# Altium schematic sheet [13]-KB_CONNECTORS.SchDoc
size A4
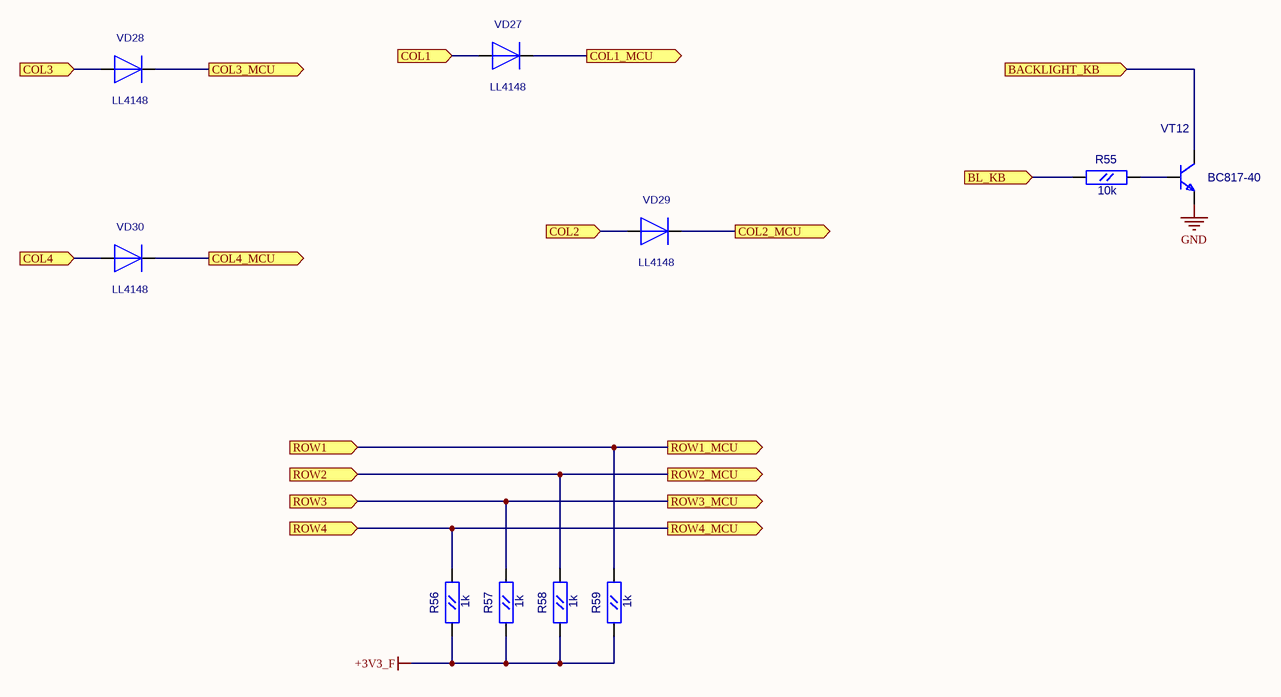
[diagram p0: [13]-KB_CONNECTORS.SchDoc]

## Parts
R55  10k  [RC0603]
R56  1k  [RC0603]
R57  1k  [RC0603]
R58  1k  [RC0603]
R59  1k  [RC0603]
VD27  LL4148  [SOD-80]
VD28  LL4148  [SOD-80]
VD29  LL4148  [SOD-80]
VD30  LL4148  [SOD-80]
VT12  BC817-40  [SOT-23(123)]

## Ports
BACKLIGHT_KB (in), BL_KB (in), COL1 (in), COL1_MCU (out), COL2 (in), COL2_MCU (out), COL3 (in), COL3_MCU (out), COL4 (in), COL4_MCU (out), ROW1 (in), ROW1_MCU (out), ROW2 (in), ROW2_MCU (out), ROW3 (in), ROW3_MCU (out), ROW4 (in), ROW4_MCU (out)

## Nets
+3V3_F: R56.1(A) R57.1(A) R58.1(A) R59.1(A)
GND: VT12.2(E)
BACKLIGHT_KB: VT12.3(C) ; port BACKLIGHT_KB
BL_KB: R55.1(A) ; port BL_KB
COL1: VD27.1(-) ; port COL1
COL1_MCU: VD27.2(+) ; port COL1_MCU
COL2: VD29.1(-) ; port COL2
COL2_MCU: VD29.2(+) ; port COL2_MCU
COL3: VD28.1(-) ; port COL3
COL3_MCU: VD28.2(+) ; port COL3_MCU
COL4: VD30.1(-) ; port COL4
COL4_MCU: VD30.2(+) ; port COL4_MCU
ROW1: R59.2(B) ; port ROW1_MCU, port ROW1
ROW2: R58.2(B) ; port ROW2_MCU, port ROW2
ROW3: R57.2(B) ; port ROW3_MCU, port ROW3
ROW4: R56.2(B) ; port ROW4_MCU, port ROW4
NetR55_2: R55.2(B) VT12.1(B)

## Library data of the parts
R55-R59 = RC0603
  R55: Value: 10k
  R56-R59: Value: 1k
VT12 = BC846BLT1: NPN 500ma transistor; ComponentField7: Published 29-Sep-2000; OriginalName: BC846BLT1; Value: BC817-40
VD27-VD30 = LL4148: Value: *